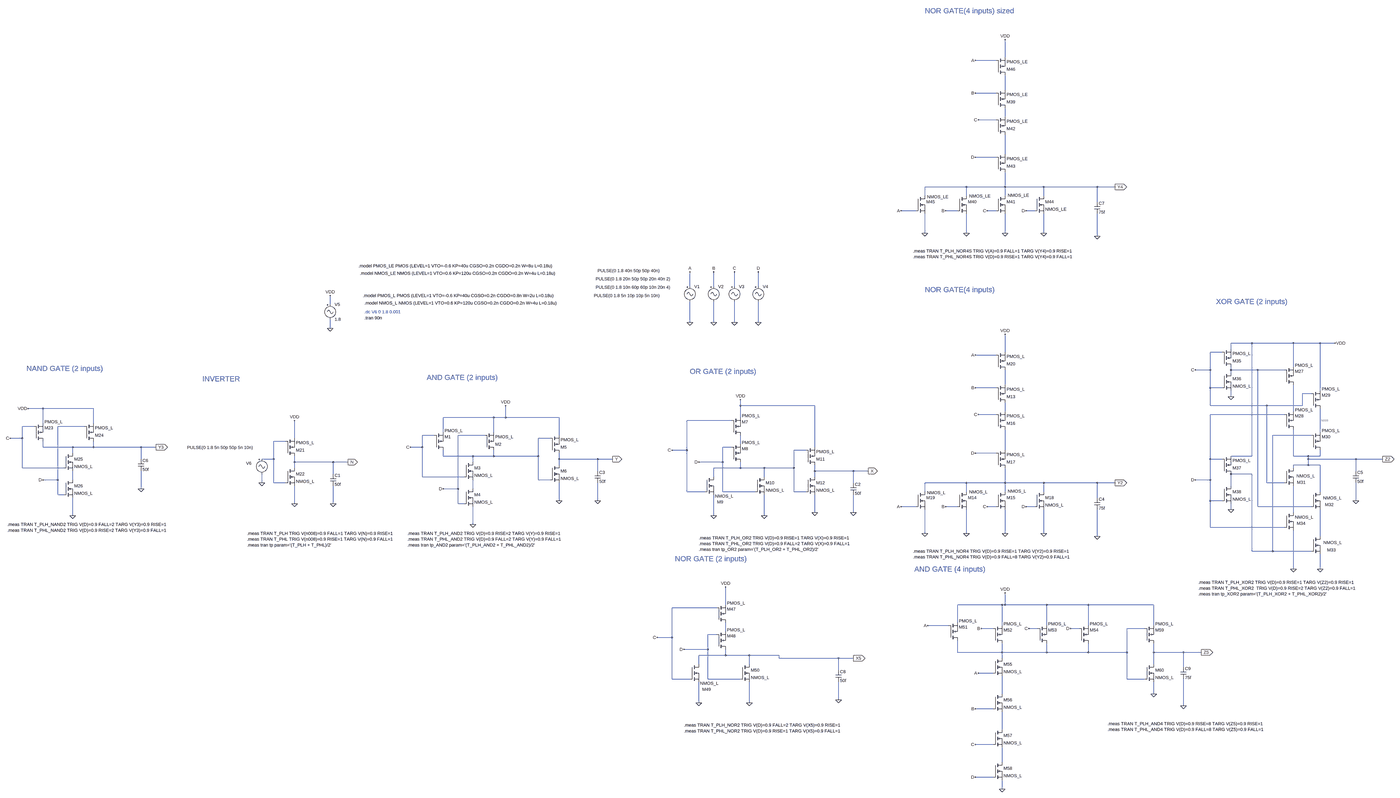
[diagram p0: schematic Gates.asc, whole sheet]
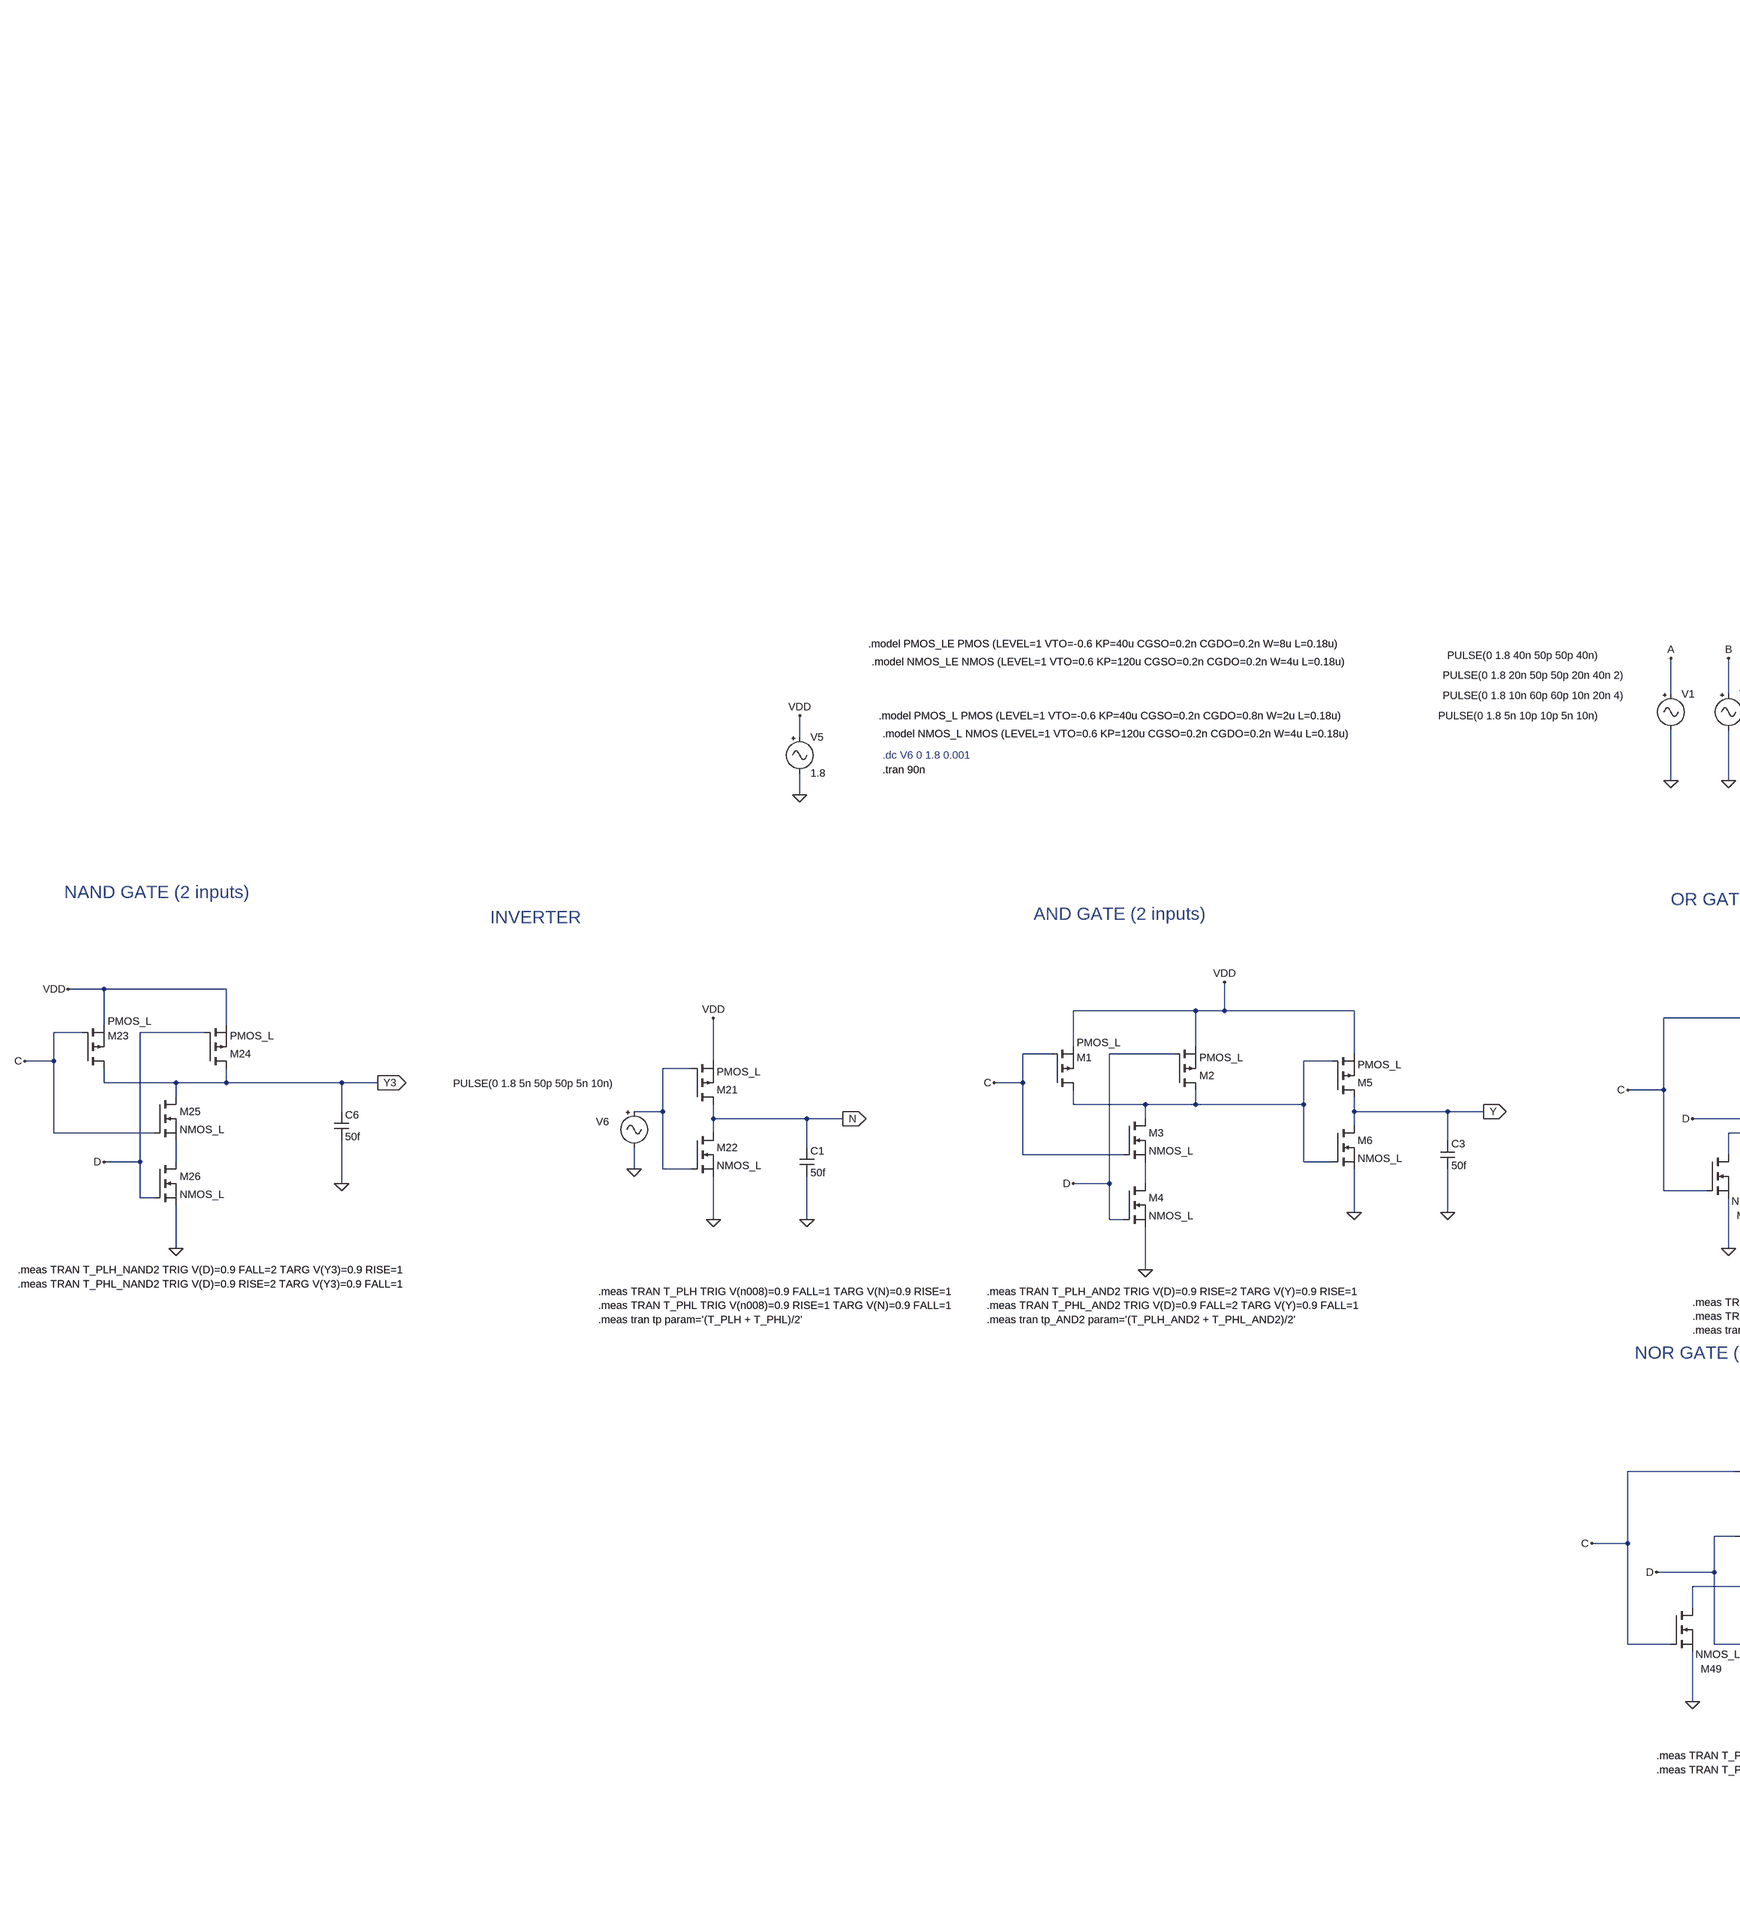
[diagram p1: schematic Gates.asc, part, row 1 of 1, column 1 of 2]
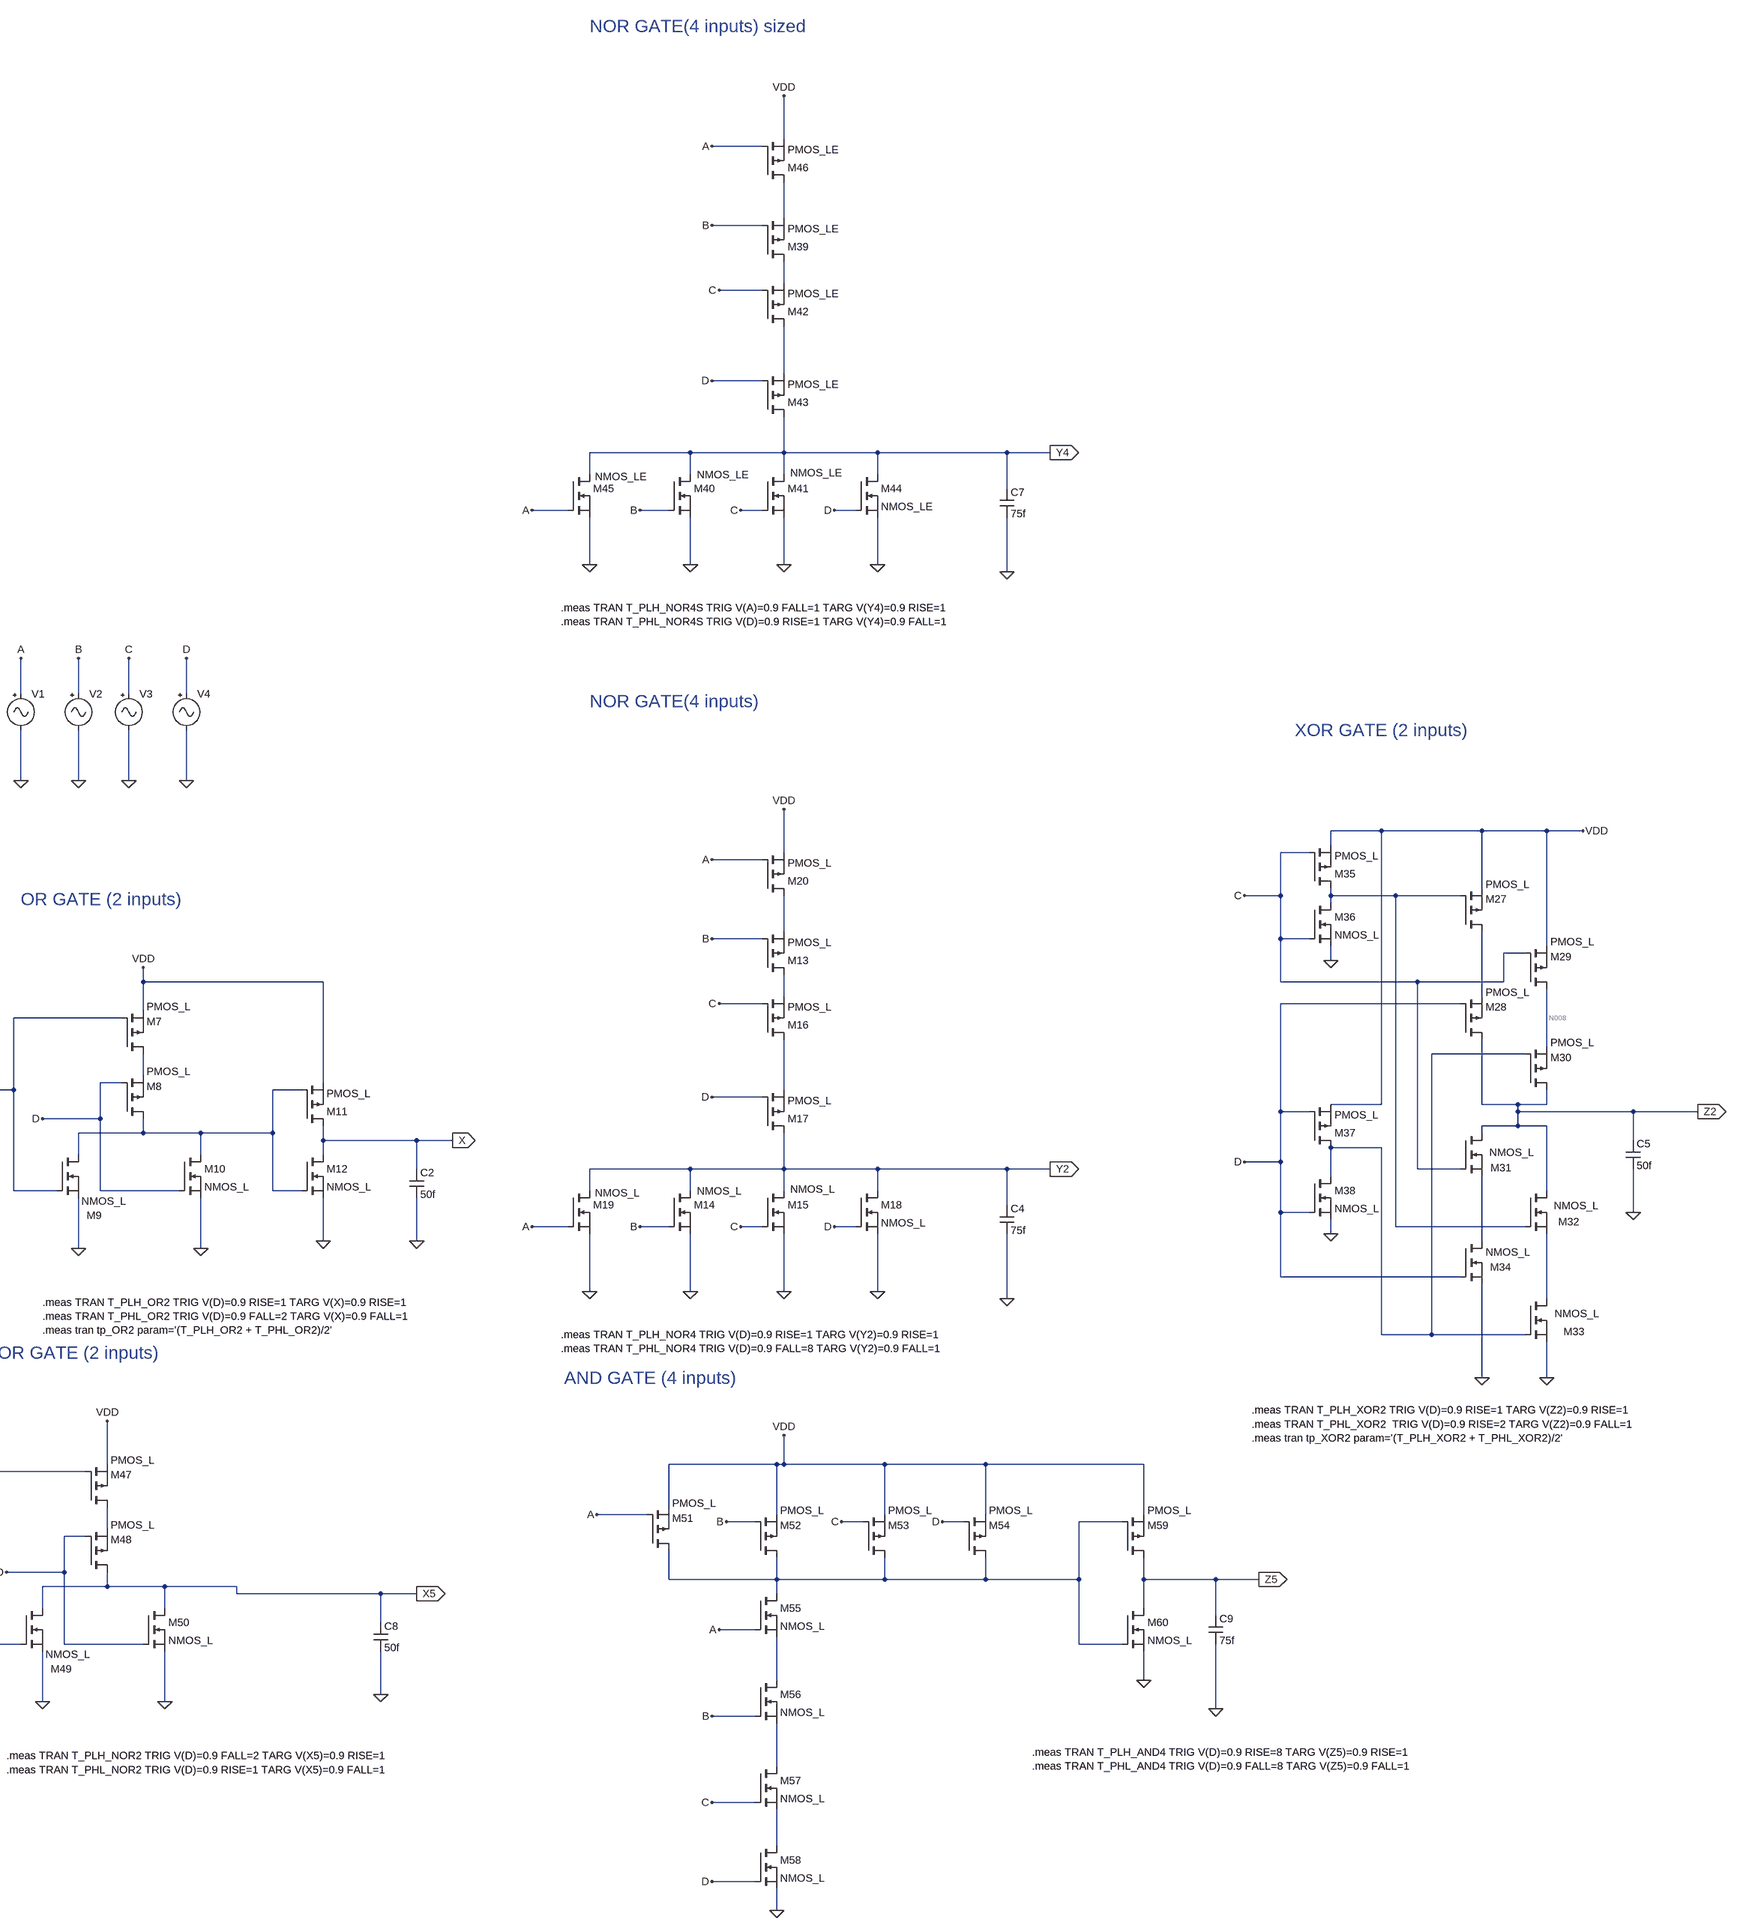
[diagram p2: schematic Gates.asc, part, row 1 of 1, column 2 of 2]
Gates.asc, the LTspice schematic file:
Version 4.1
SHEET 1 5176 2724
WIRE 3056 -1328 3056 -1424
WIRE 3008 -1312 2896 -1312
WIRE 3056 -1152 3056 -1232
WIRE 3008 -1136 2896 -1136
WIRE 3056 -1008 3056 -1056
WIRE 3008 -992 2912 -992
WIRE 3056 -800 3056 -912
WIRE 3008 -784 2896 -784
WIRE 2848 -624 2624 -624
WIRE 3056 -624 3056 -704
WIRE 3056 -624 2848 -624
WIRE 3264 -624 3056 -624
WIRE 3552 -624 3264 -624
WIRE 3648 -624 3552 -624
WIRE 2624 -576 2624 -624
WIRE 2848 -576 2848 -624
WIRE 3056 -576 3056 -624
WIRE 3264 -576 3264 -624
WIRE 3552 -544 3552 -624
WIRE 2576 -496 2496 -496
WIRE 2800 -496 2736 -496
WIRE 3008 -496 2960 -496
WIRE 3216 -496 3168 -496
WIRE 2624 -352 2624 -480
WIRE 2848 -352 2848 -480
WIRE 3056 -352 3056 -480
WIRE 3264 -352 3264 -480
WIRE 3552 -336 3552 -480
WIRE 1168 -64 1168 -144
WIRE 1296 -64 1296 -144
WIRE 1408 -64 1408 -144
WIRE 1536 -64 1536 -144
WIRE -768 32 -768 -16
WIRE 1168 128 1168 16
WIRE 1296 128 1296 16
WIRE 1408 128 1408 16
WIRE 1536 128 1536 16
WIRE -768 160 -768 112
WIRE 4384 240 4272 240
WIRE 4608 240 4384 240
WIRE 4752 240 4608 240
WIRE 4832 240 4752 240
WIRE 4272 272 4272 240
WIRE 3056 288 3056 192
WIRE 4224 288 4160 288
WIRE 3008 304 2896 304
WIRE 4608 368 4608 240
WIRE 4160 384 4160 288
WIRE 4160 384 4080 384
WIRE 4272 384 4272 368
WIRE 4416 384 4272 384
WIRE 4560 384 4416 384
WIRE 4272 400 4272 384
WIRE 3056 464 3056 384
WIRE 3008 480 2896 480
WIRE 4160 480 4160 384
WIRE 4224 480 4160 480
WIRE 4752 496 4752 240
WIRE 4704 512 4656 512
WIRE 4272 528 4272 496
WIRE 1440 576 1440 544
WIRE 1840 576 1440 576
WIRE 4160 576 4160 480
WIRE 4464 576 4160 576
WIRE 4656 576 4656 512
WIRE 4656 576 4464 576
WIRE -2544 592 -2624 592
WIRE -2272 592 -2544 592
WIRE 3056 608 3056 560
WIRE 4608 608 4608 464
WIRE 3008 624 2912 624
WIRE 4560 624 4160 624
WIRE 112 640 -160 640
WIRE 176 640 176 576
WIRE 176 640 112 640
WIRE 464 640 176 640
WIRE 1440 640 1440 576
WIRE 1392 656 1152 656
WIRE -2544 672 -2544 592
WIRE -2272 672 -2272 592
WIRE -2592 688 -2656 688
WIRE -2320 688 -2464 688
WIRE -160 720 -160 640
WIRE 112 720 112 640
WIRE 4752 720 4752 592
WIRE -208 736 -272 736
WIRE 64 736 -80 736
WIRE 464 736 464 640
WIRE 4704 736 4496 736
WIRE -2656 752 -2656 688
WIRE -2656 752 -2720 752
WIRE -960 752 -960 656
WIRE 416 752 352 752
WIRE -1008 768 -1072 768
WIRE 1440 784 1440 736
WIRE -2544 800 -2544 768
WIRE -2384 800 -2544 800
WIRE -2272 800 -2272 768
WIRE -2272 800 -2384 800
WIRE -2016 800 -2272 800
WIRE -1936 800 -2016 800
WIRE -272 800 -272 736
WIRE -272 800 -336 800
WIRE 1392 800 1344 800
WIRE 1840 800 1840 576
WIRE 1152 816 1152 656
WIRE 1152 816 1072 816
WIRE 1792 816 1728 816
WIRE 3056 816 3056 704
WIRE -2384 832 -2384 800
WIRE 3008 832 2896 832
WIRE -160 848 -160 816
WIRE 0 848 -160 848
WIRE 112 848 112 816
WIRE 112 848 0 848
WIRE 352 848 352 752
WIRE 352 848 112 848
WIRE 4384 848 4384 240
WIRE 4384 848 4272 848
WIRE 4608 848 4608 704
WIRE 4688 848 4608 848
WIRE 4752 848 4752 816
WIRE 4752 848 4688 848
WIRE -2016 864 -2016 800
WIRE -1072 864 -1072 768
WIRE -1072 864 -1136 864
WIRE 464 864 464 832
WIRE 672 864 464 864
WIRE 752 864 672 864
WIRE 4160 864 4160 624
WIRE 4224 864 4160 864
WIRE 4688 864 4688 848
WIRE 4944 864 4688 864
WIRE 5088 864 4944 864
WIRE -960 880 -960 848
WIRE -752 880 -960 880
WIRE -672 880 -752 880
WIRE 0 880 0 848
WIRE 1344 880 1344 800
WIRE 1344 880 1216 880
WIRE 464 896 464 864
WIRE 4688 896 4688 864
WIRE 4688 896 4608 896
WIRE 4752 896 4688 896
WIRE -2656 912 -2656 752
WIRE -2432 912 -2656 912
WIRE -960 912 -960 880
WIRE 1440 912 1440 880
WIRE 1440 912 1296 912
WIRE 1568 912 1440 912
WIRE 1728 912 1728 816
WIRE 1728 912 1568 912
WIRE 4608 912 4608 896
WIRE 672 928 672 864
WIRE 1840 928 1840 896
WIRE 2048 928 1840 928
WIRE 2128 928 2048 928
WIRE 4944 928 4944 864
WIRE -752 944 -752 880
WIRE 4384 944 4272 944
WIRE -272 960 -272 800
WIRE -48 960 -272 960
WIRE 1296 960 1296 912
WIRE 1568 960 1568 912
WIRE 1840 960 1840 928
WIRE -2464 976 -2464 688
WIRE -2464 976 -2544 976
WIRE -2384 976 -2384 928
WIRE 352 976 352 848
WIRE 416 976 352 976
WIRE 4160 976 4160 864
WIRE 4160 976 4080 976
WIRE -1136 992 -1136 944
WIRE -1072 992 -1072 864
WIRE -1008 992 -1072 992
WIRE 2048 992 2048 928
WIRE 2848 992 2624 992
WIRE 3056 992 3056 912
WIRE 3056 992 2848 992
WIRE 3264 992 3056 992
WIRE 3552 992 3264 992
WIRE 3648 992 3552 992
WIRE 4464 992 4464 576
WIRE 4560 992 4464 992
WIRE 4272 1008 4272 944
WIRE -2016 1024 -2016 928
WIRE -80 1024 -80 736
WIRE -80 1024 -160 1024
WIRE 0 1024 0 976
WIRE 1152 1040 1152 816
WIRE 1248 1040 1152 1040
WIRE 1344 1040 1344 880
WIRE 1520 1040 1344 1040
WIRE 1728 1040 1728 912
WIRE 1792 1040 1728 1040
WIRE 2624 1040 2624 992
WIRE 2848 1040 2848 992
WIRE 3056 1040 3056 992
WIRE 3264 1040 3264 992
WIRE 4752 1040 4752 896
WIRE -2464 1056 -2464 976
WIRE -2432 1056 -2464 1056
WIRE 3552 1072 3552 992
WIRE 464 1088 464 992
WIRE 672 1088 672 992
WIRE 4160 1088 4160 976
WIRE 4224 1088 4160 1088
WIRE 4944 1088 4944 992
WIRE -960 1104 -960 1008
WIRE -752 1104 -752 1008
WIRE -80 1104 -80 1024
WIRE -48 1104 -80 1104
WIRE 2576 1120 2496 1120
WIRE 2800 1120 2736 1120
WIRE 3008 1120 2960 1120
WIRE 3216 1120 3168 1120
WIRE 4416 1120 4416 384
WIRE 4704 1120 4416 1120
WIRE 4272 1136 4272 1104
WIRE 1840 1152 1840 1056
WIRE 2048 1152 2048 1056
WIRE 4608 1152 4608 1008
WIRE -2384 1168 -2384 1072
WIRE 1296 1168 1296 1056
WIRE 1568 1168 1568 1056
WIRE 0 1216 0 1120
WIRE 4160 1232 4160 1088
WIRE 4560 1232 4160 1232
WIRE 2624 1264 2624 1136
WIRE 2848 1264 2848 1136
WIRE 3056 1264 3056 1136
WIRE 3264 1264 3264 1136
WIRE 3552 1280 3552 1136
WIRE 4752 1280 4752 1136
WIRE 4384 1360 4384 944
WIRE 4496 1360 4496 736
WIRE 4496 1360 4384 1360
WIRE 4704 1360 4496 1360
WIRE 4608 1456 4608 1248
WIRE 4752 1456 4752 1376
WIRE 1360 1648 1360 1552
WIRE 3040 1648 2800 1648
WIRE 3056 1648 3056 1584
WIRE 3056 1648 3040 1648
WIRE 3280 1648 3056 1648
WIRE 3504 1648 3280 1648
WIRE 3856 1648 3504 1648
WIRE 1312 1664 1072 1664
WIRE 2800 1744 2800 1648
WIRE 2752 1760 2640 1760
WIRE 3040 1760 3040 1648
WIRE 3280 1760 3280 1648
WIRE 3504 1760 3504 1648
WIRE 3856 1760 3856 1648
WIRE 2992 1776 2928 1776
WIRE 3232 1776 3184 1776
WIRE 3456 1776 3408 1776
WIRE 3808 1776 3712 1776
WIRE 1360 1792 1360 1744
WIRE 1312 1808 1264 1808
WIRE 1072 1824 1072 1664
WIRE 1072 1824 992 1824
WIRE 1264 1888 1264 1808
WIRE 1264 1888 1136 1888
WIRE 2800 1904 2800 1840
WIRE 3040 1904 3040 1856
WIRE 3040 1904 2800 1904
WIRE 3280 1904 3280 1856
WIRE 3280 1904 3040 1904
WIRE 3504 1904 3504 1856
WIRE 3504 1904 3280 1904
WIRE 3712 1904 3712 1776
WIRE 3712 1904 3504 1904
WIRE 3856 1904 3856 1856
WIRE 4016 1904 3856 1904
WIRE 4112 1904 4016 1904
WIRE 1360 1920 1360 1888
WIRE 1360 1920 1216 1920
WIRE 1488 1920 1360 1920
WIRE 1648 1920 1488 1920
WIRE 1648 1936 1648 1920
WIRE 1968 1936 1648 1936
WIRE 2048 1936 1968 1936
WIRE 3040 1936 3040 1904
WIRE 1216 1968 1216 1920
WIRE 1488 1968 1488 1920
WIRE 3856 1968 3856 1904
WIRE 4016 1984 4016 1904
WIRE 1968 2000 1968 1936
WIRE 2992 2016 2912 2016
WIRE 1072 2048 1072 1824
WIRE 1168 2048 1072 2048
WIRE 1264 2048 1264 1888
WIRE 1440 2048 1264 2048
WIRE 3712 2048 3712 1904
WIRE 3808 2048 3712 2048
WIRE 3040 2128 3040 2032
WIRE 3856 2128 3856 2064
WIRE 1968 2160 1968 2064
WIRE 1216 2176 1216 2064
WIRE 1488 2176 1488 2064
WIRE 4016 2192 4016 2048
WIRE 2992 2208 2896 2208
WIRE 3040 2320 3040 2224
WIRE 2992 2400 2896 2400
WIRE 3040 2496 3040 2416
WIRE 2992 2576 2896 2576
WIRE 3040 2640 3040 2592
FLAG -768 -16 VDD
FLAG -768 160 0
FLAG -960 656 VDD
FLAG 1536 128 0
FLAG -960 1104 0
FLAG -672 880 N
IOPIN -672 880 Out
FLAG -752 1104 0
FLAG 1536 -144 D
FLAG 1408 128 0
FLAG 1408 -144 C
FLAG 1296 128 0
FLAG 1296 -144 B
FLAG 1168 128 0
FLAG 1168 -144 A
FLAG 464 1088 0
FLAG 752 864 Y
IOPIN 752 864 Out
FLAG 672 1088 0
FLAG 176 576 VDD
FLAG 0 1216 0
FLAG 1440 544 VDD
FLAG 1296 1168 0
FLAG 1568 1168 0
FLAG 1840 1152 0
FLAG 2128 928 X
IOPIN 2128 928 Out
FLAG 2048 1152 0
FLAG 1216 880 D
FLAG 1072 816 C
FLAG -336 800 C
FLAG -160 1024 D
FLAG 4832 240 VDD
FLAG 4608 1456 0
FLAG 5088 864 Z2
IOPIN 5088 864 Out
FLAG 4944 1088 0
FLAG 4080 384 C
FLAG 4080 976 D
FLAG 4272 1136 0
FLAG 4272 528 0
FLAG 4752 1456 0
FLAG -1136 992 0
FLAG 2848 1264 0
FLAG 3056 1264 0
FLAG 3552 1280 0
FLAG 2912 624 C
FLAG 3056 192 VDD
FLAG 2960 1120 C
FLAG 2896 480 B
FLAG 2736 1120 B
FLAG 3264 1264 0
FLAG 2896 832 D
FLAG 3168 1120 D
FLAG 2624 1264 0
FLAG 2896 304 A
FLAG 2496 1120 A
FLAG 3648 992 Y2
IOPIN 3648 992 Out
FLAG -1936 800 Y3
IOPIN -1936 800 Out
FLAG -2016 1024 0
FLAG -2624 592 VDD
FLAG -2384 1168 0
FLAG -2720 752 C
FLAG -2544 976 D
FLAG 2848 -352 0
FLAG 3056 -352 0
FLAG 3552 -336 0
FLAG 2912 -992 C
FLAG 3056 -1424 VDD
FLAG 2960 -496 C
FLAG 2896 -1136 B
FLAG 2736 -496 B
FLAG 3264 -352 0
FLAG 2896 -784 D
FLAG 3168 -496 D
FLAG 2624 -352 0
FLAG 2896 -1312 A
FLAG 2496 -496 A
FLAG 3648 -624 Y4
IOPIN 3648 -624 Out
FLAG 1360 1552 VDD
FLAG 1216 2176 0
FLAG 1488 2176 0
FLAG 2048 1936 X5
IOPIN 2048 1936 Out
FLAG 1968 2160 0
FLAG 1136 1888 D
FLAG 992 1824 C
FLAG 3040 2640 0
FLAG 2640 1760 A
FLAG 2928 1776 B
FLAG 3184 1776 C
FLAG 3408 1776 D
FLAG 2912 2016 A
FLAG 2896 2208 B
FLAG 2896 2400 C
FLAG 2896 2576 D
FLAG 3056 1584 VDD
FLAG 4016 2192 0
FLAG 4112 1904 Z5
IOPIN 4112 1904 Out
FLAG 3856 2128 0
SYMBOL pmos -1008 848 M180
SYMATTR InstName M21
SYMATTR Value PMOS_L
SYMBOL nmos -1008 912 R0
SYMATTR InstName M22
SYMATTR Value NMOS_L
SYMBOL Misc\\signal -768 16 R0
WINDOW 123 0 0 Left 0
WINDOW 39 0 0 Left 0
SYMATTR InstName V5
SYMATTR Value 1.8
SYMBOL Misc\\signal 1536 -80 R0
WINDOW 3 -885 64 Left 2
WINDOW 123 0 0 Left 0
WINDOW 39 0 0 Left 0
SYMATTR Value PULSE(0 1.8 5n 10p 10p 5n 10n)
SYMATTR InstName V4
SYMBOL cap -768 944 R0
SYMATTR InstName C1
SYMATTR Value 50f
SYMBOL Misc\\signal 1408 -80 R0
WINDOW 3 -747 19 Left 2
WINDOW 123 0 0 Left 0
WINDOW 39 0 0 Left 0
SYMATTR Value PULSE(0 1.8 10n 60p 60p 10n 20n 4)
SYMATTR InstName V3
SYMBOL Misc\\signal 1296 -80 R0
WINDOW 3 -635 -26 Left 2
WINDOW 123 0 0 Left 0
WINDOW 39 0 0 Left 0
SYMATTR Value PULSE(0 1.8 20n 50p 50p 20n 40n 2)
SYMATTR InstName V2
SYMBOL Misc\\signal 1168 -80 R0
WINDOW 3 -497 -70 Left 2
WINDOW 123 0 0 Left 0
WINDOW 39 0 0 Left 0
SYMATTR Value PULSE(0 1.8 40n 50p 50p 40n)
SYMATTR InstName V1
SYMBOL pmos -208 816 M180
WINDOW 0 56 72 Left 2
WINDOW 3 56 105 Left 2
SYMATTR InstName M1
SYMATTR Value PMOS_L
SYMBOL pmos 64 816 M180
SYMATTR InstName M2
SYMATTR Value PMOS_L
SYMBOL nmos -48 880 R0
SYMATTR InstName M3
SYMATTR Value NMOS_L
SYMBOL nmos -48 1024 R0
SYMATTR InstName M4
SYMATTR Value NMOS_L
SYMBOL pmos 416 832 M180
SYMATTR InstName M5
SYMATTR Value PMOS_L
SYMBOL nmos 416 896 R0
SYMATTR InstName M6
SYMATTR Value NMOS_L
SYMBOL cap 656 928 R0
SYMATTR InstName C3
SYMATTR Value 50f
SYMBOL pmos 1392 736 M180
WINDOW 0 56 72 Left 2
WINDOW 3 56 105 Left 2
SYMATTR InstName M7
SYMATTR Value PMOS_L
SYMBOL pmos 1392 880 M180
WINDOW 0 56 72 Left 2
WINDOW 3 56 105 Left 2
SYMATTR InstName M8
SYMATTR Value PMOS_L
SYMBOL nmos 1248 960 R0
WINDOW 0 66 135 Left 2
WINDOW 3 55 103 Left 2
SYMATTR InstName M9
SYMATTR Value NMOS_L
SYMBOL nmos 1520 960 R0
SYMATTR InstName M10
SYMATTR Value NMOS_L
SYMBOL pmos 1792 896 M180
SYMATTR InstName M11
SYMATTR Value PMOS_L
SYMBOL nmos 1792 960 R0
SYMATTR InstName M12
SYMATTR Value NMOS_L
SYMBOL cap 2032 992 R0
SYMATTR InstName C2
SYMATTR Value 50f
SYMBOL pmos 4560 464 M180
WINDOW 0 56 72 Left 2
WINDOW 3 56 105 Left 2
SYMATTR InstName M27
SYMATTR Value PMOS_L
SYMBOL pmos 4560 704 M180
WINDOW 0 56 72 Left 2
WINDOW 3 56 105 Left 2
SYMATTR InstName M28
SYMATTR Value PMOS_L
SYMBOL pmos 4704 592 M180
WINDOW 0 56 72 Left 2
WINDOW 3 56 105 Left 2
SYMATTR InstName M29
SYMATTR Value PMOS_L
SYMBOL pmos 4704 816 M180
WINDOW 0 56 72 Left 2
WINDOW 3 56 105 Left 2
SYMATTR InstName M30
SYMATTR Value PMOS_L
SYMBOL nmos 4560 912 R0
WINDOW 0 67 77 Left 2
WINDOW 3 64 43 Left 2
SYMATTR InstName M31
SYMATTR Value NMOS_L
SYMBOL nmos 4704 1040 R0
WINDOW 0 74 69 Left 2
WINDOW 3 64 33 Left 2
SYMATTR InstName M32
SYMATTR Value NMOS_L
SYMBOL nmos 4704 1280 R0
WINDOW 0 85 73 Left 2
WINDOW 3 65 33 Left 2
SYMATTR InstName M33
SYMATTR Value NMOS_L
SYMBOL nmos 4560 1152 R0
WINDOW 0 66 58 Left 2
WINDOW 3 56 25 Left 2
SYMATTR InstName M34
SYMATTR Value NMOS_L
SYMBOL cap 4928 928 R0
SYMATTR InstName C5
SYMATTR Value 50f
SYMBOL pmos 4224 368 M180
SYMATTR InstName M35
SYMATTR Value PMOS_L
SYMBOL nmos 4224 400 R0
SYMATTR InstName M36
SYMATTR Value NMOS_L
SYMBOL pmos 4224 944 M180
SYMATTR InstName M37
SYMATTR Value PMOS_L
SYMBOL nmos 4224 1008 R0
SYMATTR InstName M38
SYMATTR Value NMOS_L
SYMBOL Misc\\signal -1136 848 R0
WINDOW 3 -402 -46 Left 2
WINDOW 123 0 0 Left 0
WINDOW 39 0 0 Left 0
WINDOW 0 -85 39 Left 2
SYMATTR Value PULSE(0 1.8 5n 50p 50p 5n 10n)
SYMATTR InstName V6
SYMBOL pmos 3008 560 M180
SYMATTR InstName M13
SYMATTR Value PMOS_L
SYMBOL nmos 2800 1040 R0
WINDOW 3 63 1 Left 2
SYMATTR Value NMOS_L
SYMATTR InstName M14
SYMBOL nmos 3008 1040 R0
WINDOW 3 62 -3 Left 2
SYMATTR Value NMOS_L
SYMATTR InstName M15
SYMBOL pmos 3008 704 M180
SYMATTR InstName M16
SYMATTR Value PMOS_L
SYMBOL pmos 3008 912 M180
SYMATTR InstName M17
SYMATTR Value PMOS_L
SYMBOL nmos 3216 1040 R0
SYMATTR InstName M18
SYMATTR Value NMOS_L
SYMBOL nmos 2576 1040 R0
WINDOW 3 60 5 Left 2
SYMATTR Value NMOS_L
SYMATTR InstName M19
SYMBOL pmos 3008 384 M180
SYMATTR InstName M20
SYMATTR Value PMOS_L
SYMBOL cap 3536 1072 R0
SYMATTR InstName C4
SYMATTR Value 75f
SYMBOL pmos -2592 768 M180
WINDOW 0 56 72 Left 2
WINDOW 3 56 105 Left 2
SYMATTR InstName M23
SYMATTR Value PMOS_L
SYMBOL pmos -2320 768 M180
SYMATTR InstName M24
SYMATTR Value PMOS_L
SYMBOL nmos -2432 832 R0
SYMATTR InstName M25
SYMATTR Value NMOS_L
SYMBOL nmos -2432 976 R0
SYMATTR InstName M26
SYMATTR Value NMOS_L
SYMBOL cap -2032 864 R0
SYMATTR InstName C6
SYMATTR Value 50f
SYMBOL pmos 3008 -1056 M180
SYMATTR InstName M39
SYMATTR Value PMOS_LE
SYMBOL nmos 2800 -576 R0
WINDOW 3 63 1 Left 2
SYMATTR Value NMOS_LE
SYMATTR InstName M40
SYMBOL nmos 3008 -576 R0
WINDOW 3 62 -3 Left 2
SYMATTR Value NMOS_LE
SYMATTR InstName M41
SYMBOL pmos 3008 -912 M180
SYMATTR InstName M42
SYMATTR Value PMOS_LE
SYMBOL pmos 3008 -704 M180
SYMATTR InstName M43
SYMATTR Value PMOS_LE
SYMBOL nmos 3216 -576 R0
SYMATTR InstName M44
SYMATTR Value NMOS_LE
SYMBOL nmos 2576 -576 R0
WINDOW 3 60 5 Left 2
SYMATTR Value NMOS_LE
SYMATTR InstName M45
SYMBOL pmos 3008 -1232 M180
SYMATTR InstName M46
SYMATTR Value PMOS_LE
SYMBOL cap 3536 -544 R0
SYMATTR InstName C7
SYMATTR Value 75f
SYMBOL pmos 1312 1744 M180
WINDOW 0 56 72 Left 2
WINDOW 3 56 105 Left 2
SYMATTR InstName M47
SYMATTR Value PMOS_L
SYMBOL pmos 1312 1888 M180
WINDOW 0 56 72 Left 2
WINDOW 3 56 105 Left 2
SYMATTR InstName M48
SYMATTR Value PMOS_L
SYMBOL nmos 1168 1968 R0
WINDOW 0 66 135 Left 2
WINDOW 3 55 103 Left 2
SYMATTR InstName M49
SYMATTR Value NMOS_L
SYMBOL nmos 1440 1968 R0
SYMATTR InstName M50
SYMATTR Value NMOS_L
SYMBOL cap 1952 2000 R0
SYMATTR InstName C8
SYMATTR Value 50f
SYMBOL pmos 2752 1840 M180
WINDOW 0 56 72 Left 2
WINDOW 3 56 105 Left 2
SYMATTR InstName M51
SYMATTR Value PMOS_L
SYMBOL pmos 2992 1856 M180
WINDOW 0 56 72 Left 2
WINDOW 3 56 105 Left 2
SYMATTR InstName M52
SYMATTR Value PMOS_L
SYMBOL pmos 3232 1856 M180
WINDOW 0 56 72 Left 2
WINDOW 3 56 105 Left 2
SYMATTR InstName M53
SYMATTR Value PMOS_L
SYMBOL pmos 3456 1856 M180
WINDOW 0 56 72 Left 2
WINDOW 3 56 105 Left 2
SYMATTR InstName M54
SYMATTR Value PMOS_L
SYMBOL nmos 2992 1936 R0
SYMATTR InstName M55
SYMATTR Value NMOS_L
SYMBOL nmos 2992 2128 R0
SYMATTR InstName M56
SYMATTR Value NMOS_L
SYMBOL nmos 2992 2320 R0
SYMATTR InstName M57
SYMATTR Value NMOS_L
SYMBOL nmos 2992 2496 R0
SYMATTR InstName M58
SYMATTR Value NMOS_L
SYMBOL cap 4000 1984 R0
SYMATTR InstName C9
SYMATTR Value 75f
SYMBOL pmos 3808 1856 M180
WINDOW 0 56 72 Left 2
WINDOW 3 56 105 Left 2
SYMATTR InstName M59
SYMATTR Value PMOS_L
SYMBOL nmos 3808 1968 R0
SYMATTR InstName M60
SYMATTR Value NMOS_L
TEXT -584 104 Left 2 !.tran 90n
TEXT -592 -16 Left 2 !.model PMOS_L PMOS (LEVEL=1 VTO=-0.6 KP=40u CGSO=0.2n CGDO=0.8n W=2u L=0.18u)
TEXT -584 24 Left 2 !.model NMOS_L NMOS (LEVEL=1 VTO=0.6 KP=120u CGSO=0.2n CGDO=0.2n W=4u L=0.18u)
TEXT -584 72 Left 2 ;.dc V6 0 1.8 0.001
TEXT -352 1264 Left 2 !.meas TRAN T_PLH_AND2 TRIG V(D)=0.9 RISE=2 TARG V(Y)=0.9 RISE=1\n.meas TRAN T_PHL_AND2 TRIG V(D)=0.9 FALL=2 TARG V(Y)=0.9 FALL=1  \n.meas tran tp_AND2 param='(T_PLH_AND2 + T_PHL_AND2)/2'
TEXT -616 -176 Left 2 !.model PMOS_LE PMOS (LEVEL=1 VTO=-0.6 KP=40u CGSO=0.2n CGDO=0.2n W=8u L=0.18u)
TEXT -608 -136 Left 2 !.model NMOS_LE NMOS (LEVEL=1 VTO=0.6 KP=120u CGSO=0.2n CGDO=0.2n W=4u L=0.18u)
TEXT -1456 432 Left 4 ;INVERTER
TEXT -248 424 Left 4 ;AND GATE (2 inputs)
TEXT 1168 392 Left 4 ;OR GATE (2 inputs)
TEXT 2624 -48 Left 4 ;NOR GATE(4 inputs)
TEXT 4192 16 Left 4 ;XOR GATE (2 inputs)
TEXT -1216 1264 Left 2 !.meas TRAN T_PLH TRIG V(n008)=0.9 FALL=1 TARG V(N)=0.9 RISE=1\n.meas TRAN T_PHL TRIG V(n008)=0.9 RISE=1 TARG V(N)=0.9 FALL=1  \n.meas tran tp param='(T_PLH + T_PHL)/2'
TEXT 1216 1288 Left 2 !.meas TRAN T_PLH_OR2 TRIG V(D)=0.9 RISE=1 TARG V(X)=0.9 RISE=1\n.meas TRAN T_PHL_OR2 TRIG V(D)=0.9 FALL=2 TARG V(X)=0.9 FALL=1  \n.meas tran tp_OR2 param='(T_PLH_OR2 + T_PHL_OR2)/2'
TEXT 2560 1360 Left 2 !.meas TRAN T_PLH_NOR4 TRIG V(D)=0.9 RISE=1 TARG V(Y2)=0.9 RISE=1\n.meas TRAN T_PHL_NOR4 TRIG V(D)=0.9 FALL=8 TARG V(Y2)=0.9 FALL=1
TEXT 4096 1528 Left 2 !.meas TRAN T_PLH_XOR2 TRIG V(D)=0.9 RISE=1 TARG V(Z2)=0.9 RISE=1\n.meas TRAN T_PHL_XOR2  TRIG V(D)=0.9 RISE=2 TARG V(Z2)=0.9 FALL=1  \n.meas tran tp_XOR2 param='(T_PLH_XOR2 + T_PHL_XOR2)/2'
TEXT -2736 1216 Left 2 !.meas TRAN T_PLH_NAND2 TRIG V(D)=0.9 FALL=2 TARG V(Y3)=0.9 RISE=1\n.meas TRAN T_PHL_NAND2 TRIG V(D)=0.9 RISE=2 TARG V(Y3)=0.9 FALL=1
TEXT -2632 376 Left 4 ;NAND GATE (2 inputs)
TEXT 2624 -1664 Left 4 ;NOR GATE(4 inputs) sized
TEXT 2560 -256 Left 2 !.meas TRAN T_PLH_NOR4S TRIG V(A)=0.9 FALL=1 TARG V(Y4)=0.9 RISE=1\n.meas TRAN T_PHL_NOR4S TRIG V(D)=0.9 RISE=1 TARG V(Y4)=0.9 FALL=1
TEXT 1088 1400 Left 4 ;NOR GATE (2 inputs)
TEXT 1136 2296 Left 2 !.meas TRAN T_PLH_NOR2 TRIG V(D)=0.9 FALL=2 TARG V(X5)=0.9 RISE=1\n.meas TRAN T_PHL_NOR2 TRIG V(D)=0.9 RISE=1 TARG V(X5)=0.9 FALL=1
TEXT 3608 2288 Left 2 !.meas TRAN T_PLH_AND4 TRIG V(D)=0.9 RISE=8 TARG V(Z5)=0.9 RISE=1\n.meas TRAN T_PHL_AND4 TRIG V(D)=0.9 FALL=8 TARG V(Z5)=0.9 FALL=1
TEXT 2568 1456 Left 4 ;AND GATE (4 inputs)

The netlist it stands for:
* Gates.asc
M21 N N011 VDD VDD PMOS_L
M22 N N011 0 0 NMOS_L
V5 VDD 0 1.8
V4 D 0 PULSE(0 1.8 5n 10p 10p 5n 10n)
C1 N 0 50f
V3 C 0 PULSE(0 1.8 10n 60p 60p 10n 20n 4)
V2 B 0 PULSE(0 1.8 20n 50p 50p 20n 40n 2)
V1 A 0 PULSE(0 1.8 40n 50p 50p 40n)
M1 N010 C VDD VDD PMOS_L
M2 N010 D VDD VDD PMOS_L
M3 N010 C N016 N016 NMOS_L
M4 N016 D 0 0 NMOS_L
M5 Y N010 VDD VDD PMOS_L
M6 Y N010 0 0 NMOS_L
C3 Y 0 50f
M7 N012 C VDD VDD PMOS_L
M8 N013 D N012 N012 PMOS_L
M9 N013 C 0 0 NMOS_L
M10 N013 D 0 0 NMOS_L
M11 X N013 VDD VDD PMOS_L
M12 X N013 0 0 NMOS_L
C2 X 0 50f
M27 N007 N004 VDD VDD PMOS_L
M28 Z2 D N007 N007 PMOS_L
M29 N008 C VDD VDD PMOS_L
M30 Z2 N009 N008 N008 PMOS_L
M31 Z2 C N017 N017 NMOS_L
M32 Z2 N004 N018 N018 NMOS_L
M33 N018 N009 0 0 NMOS_L
M34 N017 D 0 0 NMOS_L
C5 Z2 0 50f
M35 N004 C VDD VDD PMOS_L
M36 N004 C 0 0 NMOS_L
M37 N009 D VDD VDD PMOS_L
M38 N009 D 0 0 NMOS_L
V6 N011 0 PULSE(0 1.8 5n 50p 50p 5n 10n)
M13 N006 B N005 N005 PMOS_L
M14 Y2 B 0 0 NMOS_L
M15 Y2 C 0 0 NMOS_L
M16 N014 C N006 N006 PMOS_L
M17 Y2 D N014 N014 PMOS_L
M18 Y2 D 0 0 NMOS_L
M19 Y2 A 0 0 NMOS_L
M20 N005 A VDD VDD PMOS_L
C4 Y2 0 75f
M23 Y3 C VDD VDD PMOS_L
M24 Y3 D VDD VDD PMOS_L
M25 Y3 C N015 N015 NMOS_L
M26 N015 D 0 0 NMOS_L
C6 Y3 0 50f
M39 N002 B N001 N001 PMOS_LE
M40 Y4 B 0 0 NMOS_LE
M41 Y4 C 0 0 NMOS_LE
M42 N003 C N002 N002 PMOS_LE
M43 Y4 D N003 N003 PMOS_LE
M44 Y4 D 0 0 NMOS_LE
M45 Y4 A 0 0 NMOS_LE
M46 N001 A VDD VDD PMOS_LE
C7 Y4 0 75f
M47 N020 C VDD VDD PMOS_L
M48 X5 D N020 N020 PMOS_L
M49 X5 C 0 0 NMOS_L
M50 X5 D 0 0 NMOS_L
C8 X5 0 50f
M51 N019 A VDD VDD PMOS_L
M52 N019 B VDD VDD PMOS_L
M53 N019 C VDD VDD PMOS_L
M54 N019 D VDD VDD PMOS_L
M55 N019 A N021 N021 NMOS_L
M56 N021 B N022 N022 NMOS_L
M57 N022 C N023 N023 NMOS_L
M58 N023 D 0 0 NMOS_L
C9 Z5 0 75f
M59 Z5 N019 VDD VDD PMOS_L
M60 Z5 N019 0 0 NMOS_L
.model NMOS NMOS
.model PMOS PMOS
.lib standard.mos
.tran 90n
.model PMOS_L PMOS (LEVEL=1 VTO=-0.6 KP=40u CGSO=0.2n CGDO=0.8n W=2u L=0.18u)
.model NMOS_L NMOS (LEVEL=1 VTO=0.6 KP=120u CGSO=0.2n CGDO=0.2n W=4u L=0.18u)
* .dc V6 0 1.8 0.001
.meas TRAN T_PLH_AND2 TRIG V(D)=0.9 RISE=2 TARG V(Y)=0.9 RISE=1
.meas TRAN T_PHL_AND2 TRIG V(D)=0.9 FALL=2 TARG V(Y)=0.9 FALL=1
.meas tran tp_AND2 param='(T_PLH_AND2 + T_PHL_AND2)/2'
.model PMOS_LE PMOS (LEVEL=1 VTO=-0.6 KP=40u CGSO=0.2n CGDO=0.2n W=8u L=0.18u)
.model NMOS_LE NMOS (LEVEL=1 VTO=0.6 KP=120u CGSO=0.2n CGDO=0.2n W=4u L=0.18u)
* INVERTER
* AND GATE (2 inputs)
* OR GATE (2 inputs)
* NOR GATE(4 inputs)
* XOR GATE (2 inputs)
.meas TRAN T_PLH TRIG V(n008)=0.9 FALL=1 TARG V(N)=0.9 RISE=1
.meas TRAN T_PHL TRIG V(n008)=0.9 RISE=1 TARG V(N)=0.9 FALL=1
.meas tran tp param='(T_PLH + T_PHL)/2'
.meas TRAN T_PLH_OR2 TRIG V(D)=0.9 RISE=1 TARG V(X)=0.9 RISE=1
.meas TRAN T_PHL_OR2 TRIG V(D)=0.9 FALL=2 TARG V(X)=0.9 FALL=1
.meas tran tp_OR2 param='(T_PLH_OR2 + T_PHL_OR2)/2'
.meas TRAN T_PLH_NOR4 TRIG V(D)=0.9 RISE=1 TARG V(Y2)=0.9 RISE=1
.meas TRAN T_PHL_NOR4 TRIG V(D)=0.9 FALL=8 TARG V(Y2)=0.9 FALL=1
.meas TRAN T_PLH_XOR2 TRIG V(D)=0.9 RISE=1 TARG V(Z2)=0.9 RISE=1
.meas TRAN T_PHL_XOR2  TRIG V(D)=0.9 RISE=2 TARG V(Z2)=0.9 FALL=1
.meas tran tp_XOR2 param='(T_PLH_XOR2 + T_PHL_XOR2)/2'
.meas TRAN T_PLH_NAND2 TRIG V(D)=0.9 FALL=2 TARG V(Y3)=0.9 RISE=1
.meas TRAN T_PHL_NAND2 TRIG V(D)=0.9 RISE=2 TARG V(Y3)=0.9 FALL=1
* NAND GATE (2 inputs)
* NOR GATE(4 inputs) sized
.meas TRAN T_PLH_NOR4S TRIG V(A)=0.9 FALL=1 TARG V(Y4)=0.9 RISE=1
.meas TRAN T_PHL_NOR4S TRIG V(D)=0.9 RISE=1 TARG V(Y4)=0.9 FALL=1
* NOR GATE (2 inputs)
.meas TRAN T_PLH_NOR2 TRIG V(D)=0.9 FALL=2 TARG V(X5)=0.9 RISE=1
.meas TRAN T_PHL_NOR2 TRIG V(D)=0.9 RISE=1 TARG V(X5)=0.9 FALL=1
.meas TRAN T_PLH_AND4 TRIG V(D)=0.9 RISE=8 TARG V(Z5)=0.9 RISE=1
.meas TRAN T_PHL_AND4 TRIG V(D)=0.9 FALL=8 TARG V(Z5)=0.9 FALL=1
* AND GATE (4 inputs)
.backanno
.end